# EAGLE design PDM (EAGLE 6.5.0)
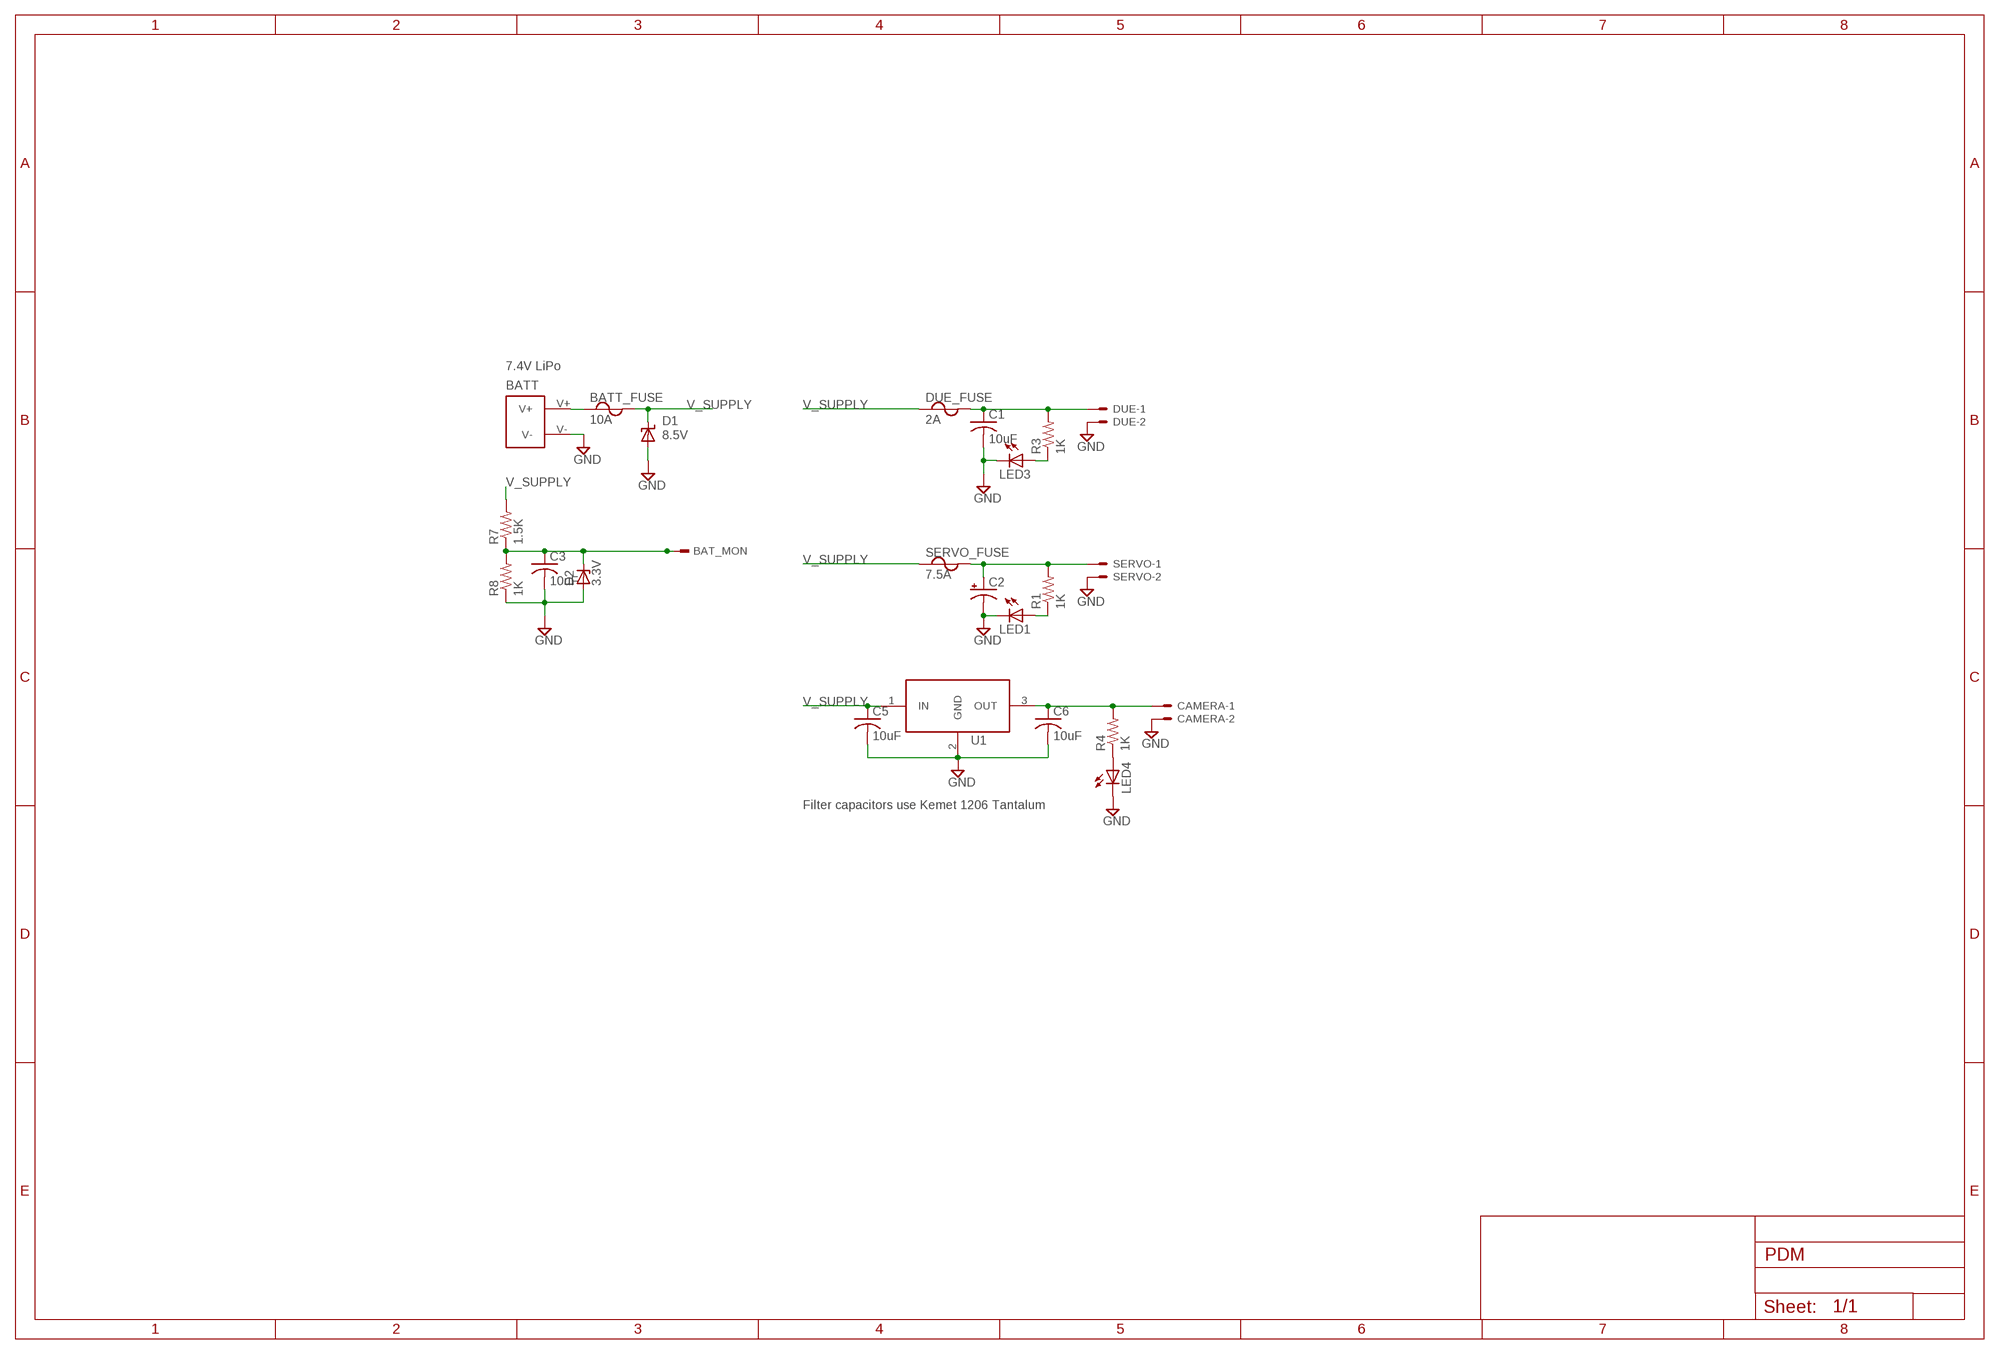
[diagram p0: schematic, sheet 1]

## Parts
BAT_MON  TSW-101-02-S-S  [TSW-101-02-S-S]
BATT  CON_XT60-  [CON_XT60_PCB_MALE]
BATT_FUSE  10A  FUSE-  [MINI_ATO]
C1  10uF  C-USC1206K  [C1206K]
C2  CPOL-USTT5D11  [TT5D11]
C3  10uF  C-USC1206K  [C1206K]
C5  10uF  C-USC1206K  [C1206K]
C6  10uF  C-USC1206K  [C1206K]
CAMERA  5566-2  [5566-2]
D1  8.5V  SUPPRESSOR-SMBJ  [SMBJ]
D2  3.3V  ZENER-DIODESOD80C  [SOD80C]
DUE  5566-2  [5566-2]
DUE_FUSE  2A  FUSE-  [MINI_ATO]
LED1  LEDSML1206  [SML1206]
LED3  LEDSML1206  [SML1206]
LED4  LEDSML1206  [SML1206]
R1  1K  R-US_R1206  [R1206]
R3  1K  R-US_R1206  [R1206]
R4  1K  R-US_R1206  [R1206]
R7  1.5K  R-US_R1206  [R1206]
R8  1K  R-US_R1206  [R1206]
SERVO  5566-2  [5566-2]
SERVO_FUSE  7.5A  FUSE-  [MINI_ATO]
U1  MIC29150/29300/29500VERTICAL  [TO220V]

## Nets
GND: BATT.V- C1.2 C2.- C3.2 C5.2 C6.2 CAMERA.2 D1.A D2.A DUE.2 LED1.C LED3.C LED4.C R8.1 SERVO.2 U1.2(GND)
N$2: BATT.V+ BATT_FUSE.P$2
N$4: C1.1 DUE.1 DUE_FUSE.P$3 R3.2
N$5: LED1.A R1.1
N$6: C6.1 CAMERA.1 R4.2 U1.3(OUT)
N$11: LED3.A R3.1
N$13: LED4.A R4.1
N$15: C2.+ R1.2 SERVO.1 SERVO_FUSE.P$3
N$18: BAT_MON.1 C3.1 D2.C R7.1 R8.2
V_SUPPLY: BATT_FUSE.P$3 C5.1 D1.C DUE_FUSE.P$2 R7.2 SERVO_FUSE.P$2 U1.1(IN)

## Notes on the sheet
- 7.4V LiPo
- Filter capacitors use Kemet 1206 Tantalum

## Library data of the parts
BAT_MON = con-samtec:TSW-101-02-S-S: THROUGH-HOLE .025" SQ POST HEADER Source: Samtec TSW.pdf; OC_FARNELL: unknown; OC_NEWARK: unknown
BATT = MRSDTeamB:CON_XT60-
BATT_FUSE DUE_FUSE SERVO_FUSE = MRSDTeamB:FUSE-: Automotive Fuse, PCB Mount Full Size: Digikey <http://www.digikey.com/product-detail/en/178.6165.0002/WK6265-ND/653477> Datasheet <http://www.littelfuse.com/data/en/Data_Sheets/Littelfuse_ATO-PCB-Fuse-holders-178.6765.pdf> Mini-ATO: DigiKey <http://www.digikey.com/product-detail/en/01530008Z/F065-ND/183334> Library Part by Nate Chapman
C1 C3 C5 C6 = rcl:C-US: CAPACITOR, American symbol
C2 = rcl:CPOL-US: POLARIZED CAPACITOR, American symbol
CAMERA DUE SERVO = con-molex:5566-2: Mini FIT connector 2 pol Source: http://www.molex.com; OC_FARNELL: 1822072; OC_NEWARK: unknown
D1 = MRSDTeamB:SUPPRESSOR-: Suppressor diode
D2 = diode:ZENER-DIODE: Z-Diode
LED1 LED3 LED4 = led:LED: LED OSRAM: - CHIPLED LG R971, LG N971, LY N971, LG Q971, LY Q971, LO R971, LY R971 LH N974, LH R974 LS Q976, LO Q976, LY Q976 LO Q996 - Hyper CHIPLED LW Q18S LB Q993, LB Q99A, LB R99A - SideLED LS A670, LO A670, LY A670, LG A670, LP A670 LB A673, LV A673, LT A673, LW A673 LH A674 LY A675 LS A676, LA A676, LO A676, LY A676, LW A676 LS A679, LY A679, LG A679 - Hyper Micro SIDELED® LS Y876, LA Y876, LO Y876, LY Y876 LT Y87S - SmartLED LW L88C, LW L88S LB L89C, LB L89S, LG L890 LS L89K, LO L89K, LY L89K LS L896, LA L896, LO L896, LY L896 - TOPLED LS T670, LO T670, LY T670, LG T670, LP T670 LSG T670, LSP T670, LSY T670, LOP T670, LYG T670 LG T671, LOG T671, LSG T671 LB T673, LV T673, LT T673, LW T673 LH T674 LS T676, LA T676, LO T676, LY T676, LB T676, LH T676, LSB T676, LW T676 LB T67C, LV T67C, LT T67C, LS T67K, LO T67K, LY T67K, LW E67C LS E67B, LA E67B, LO E67B, LY E67B, LB E67C, LV E67C, LT E67C LW T67C LS T679, LY T679, LG T679 LS T770, LO T770, LY T770, LG T770, LP T770 LB T773, LV T773, LT T773, LW T773 LH T774 LS E675, LA E675, LY E675, LS T675 LS T776, LA T776, LO T776, LY T776, LB T776 LHGB T686 LT T68C, LB T68C - Hyper Mini TOPLED® LB M676 - Mini TOPLED Santana® LG M470 LS M47K, LO M47K, LY M47K Source: http://www.osram.convergy.de LUXEON: - LUMILED® LXK2-PW12-R00, LXK2-PW12-S00, LXK2-PW14-U00, LXK2-PW14-V00 LXK2-PM12-R00, LXK2-PM12-S00, LXK2-PM14-U00 LXK2-PE12-Q00, LXK2-PE12-R00, LXK2-PE12-S00, LXK2-PE14-T00, LXK2-PE14-U00 LXK2-PB12-K00, LXK2-PB12-L00, LXK2-PB12-M00, LXK2-PB14-N00, LXK2-PB14-P00, LXK2-PB14-Q00 LXK2-PR12-L00, LXK2-PR12-M00, LXK2-PR14-Q00, LXK2-PR14-R00 LXK2-PD12-Q00, LXK2-PD12-R00, LXK2-PD12-S00 LXK2-PH12-R00, LXK2-PH12-S00 LXK2-PL12-P00, LXK2-PL12-Q00, LXK2-PL12-R00 Source: www.luxeon.com KINGBRIGHT: KA-3528ASYC Source: www.kingbright.com
R1 R3 R4 R7 R8 = rcl:R-US_: RESISTOR, American symbol
U1 = MRSDTeamB:MIC29150/29300/29500

## Board
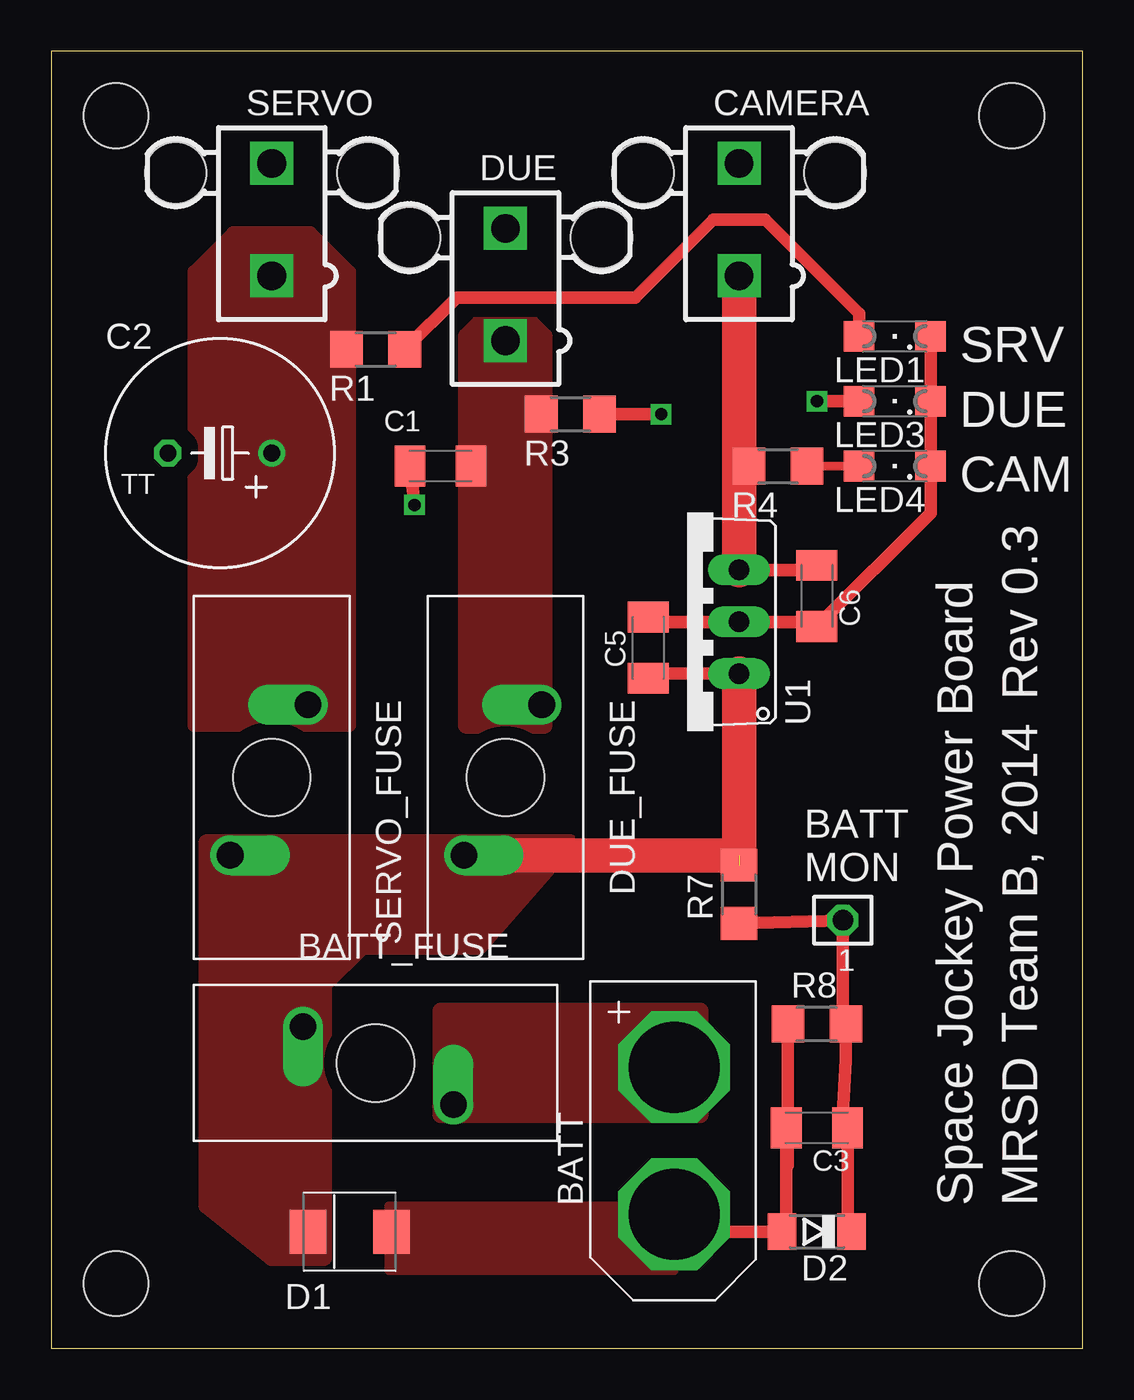
[diagram p1: board, top side]
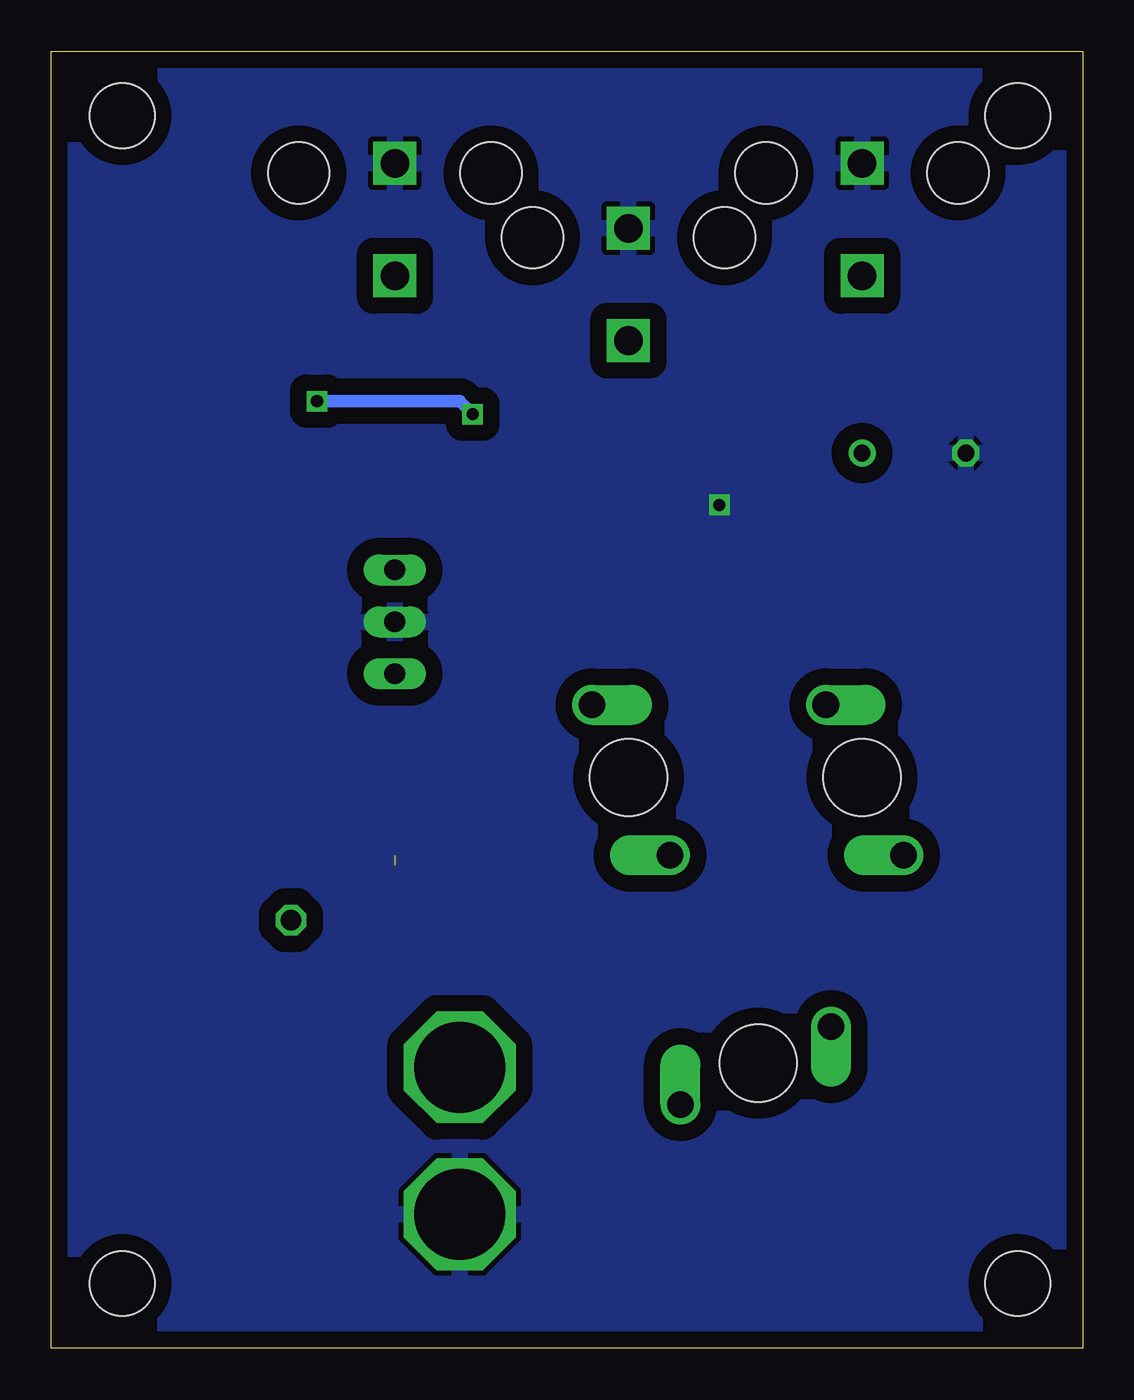
[diagram p2: board, bottom side, seen from below]

Size 50.47 x 63.49 mm. Coordinates in mm from the lower left corner, seen from the top.
Outline: 0,0 50.47,0 50.47,63.49 0,63.49 0,0
Copper layers (1*16): Top 0.035mm / dielectric 1.5mm / Bottom 0.035mm
Design rules "default *": minimum track width 10mil, minimum drill 16mil, track to track 8mil, track to pad 8mil, pad to pad 8mil, via to via 8mil, smd to smd 8mil, copper to edge 24mil, drill to drill 8mil, minimum pad ring 10mil, minimum via ring 8mil, stop-mask expansion 4mil, vias tented up to drill 0mil, thermal gap 10mil
Holes 3.17 mm at 3.17,3.17 46.99,3.17 3.17,60.33 46.99,60.33

### Footprints (pad centres in the part's own frame; a part is rotated, then mirrored left to right if it is on the bottom)
TSW-101-02-S-S = drill 1 pad 1.5 octagon: 1 0,0
CON_XT60_PCB_MALE = drill 4.445 octagon: V+ 3.6,0; V- -3.6,0
MINI_ATO = drill 1.3 offset: P$2 2.032,3.81; P$3 -1.778,-3.556 | hole 3.785: 0,0
C1206K = smd 1.5 x 2: 1 -1.5,0; 2 1.5,0
TT5D11 = drill 0.813: + -2.54,0 | drill 0.813 octagon: - 2.54,0
5566-2 = drill 1.4 square: 1 0,-2.75; 2 0,2.75 | hole 3: 4.7,2.29; -4.7,2.29
SMBJ = smd 1.78 x 2.16: A 2.04,0; C -2.03,0
SOD80C = smd 1.4 x 1.8: A 1.7,0; C -1.7,0
SML1206 = smd 1.5 x 1.5: A 1.75,0; C -1.75,0
R1206 = smd 1.6 x 1.803: 1 -1.422,0; 2 1.422,0
TO220V = drill 1.016 long: 1 -2.54,-2.54; 2 0,-2.54; 3 2.54,-2.54

### Placement (x,y rotation side)
BAT_MON  38.73,20.95 0 top
BATT  30.48,10.16 90 top
BATT_FUSE  15.88,13.97 270 top
C1  19.05,43.18 180 top
C2  8.26,43.81 180 top
C3  37.47,10.79 180 top
C5  29.21,34.29 90 top
C6  37.47,36.83 270 top
CAMERA  33.66,55.24 0 top
D1  14.61,5.71 0 top
D2  37.47,5.71 180 top
DUE  22.23,52.07 0 top
DUE_FUSE  22.23,27.94 180 top
LED1  41.27,49.53 180 top
LED3  41.27,46.35 180 top
LED4  41.27,43.18 180 top
R1  15.88,48.9 180 top
R3  25.4,45.72 180 top
R4  35.56,43.18 180 top
R7  33.66,22.23 90 top
R8  37.47,15.88 0 top
SERVO  10.79,55.24 0 top
SERVO_FUSE  10.79,27.94 180 top
U1  31.11,35.56 90 top

### Tracks (layer width: path | path; a pad name or v marks a point on that pad's centre or on a via)
GND  (via drill 0.6)
  Top 0.61: C1.2 v17.78,41.27 | C5.2 30.07,35.56 U1.2 37.47,35.56 C6.2 43.02,40.89 LED4.C LED3.C LED1.C | R8.1 36.04,8.97 C3.2 35.97,5.92 D2.A 30.69,5.71 BATT.V-
  pour Bottom (isolate 0.813): 0.64,62.87 49.53,62.87 49.53,0.64 0.64,0.64
  pour Top (isolate 1.27, no thermals): 16.51,6.99 30.48,6.99 30.48,3.81 16.51,3.81
N$2
  pour Top (isolate 0.61, no thermals): 19.05,11.43 19.05,16.51 31.75,16.51 31.75,11.43
N$4
  pour Top (isolate 0.61, no thermals): 20.32,30.48 20.32,49.53 20.95,50.16 23.5,50.16 24.13,49.53 24.13,30.48
N$5
  Top 0.61: R1.1 19.84,51.44 28.57,51.44 32.38,55.24 34.92,55.24 39.52,50.65 LED1.A
N$6
  Top 0.61: U1.3 37.23,38.1 C6.1 | R4.2 33.66,43.18
  Top 1.676: U1.3 33.66,43.18 CAMERA.1
N$11  (via drill 0.6)
  Top 0.61: R3.1 v29.84,45.72 | v37.47,46.35 LED3.A
  Bottom 0.61: v29.84,45.72 30.48,46.35 v37.47,46.35
N$13
  Top 0.406: R4.1 LED4.A
N$15
  pour Top (isolate 0.813, no thermals): 14.61,30.48 6.99,30.48 6.99,52.7 8.89,54.61 12.7,54.61 14.61,52.7
N$18
  Top 0.61: R7.1 BAT_MON.1 38.73,16.03 R8.2 38.89,14.12 38.73,11.43 38.73,10.56 C3.1 38.97,5.92 D2.C
V_SUPPLY  (1 unrouted)
  Top 0.61: U1.1 30.07,33.02 C5.1
  Top 1.676: DUE_FUSE.P$2 33.66,24.13 U1.1
  pour Top (isolate 0.61, no thermals): 13.34,17.78 13.34,4.45 10.79,4.45 7.62,6.99 7.62,24.77 25.4,24.77 20.95,19.68 15.24,19.68

### Text on the board
tPlace: SRV | DUE | CAM | Rev 0.3 | Space Jockey Power Board | MRSD Team B, 2014
tNames: BATT / MON